# EAGLE design dynacomp (EAGLE 7.6.0)
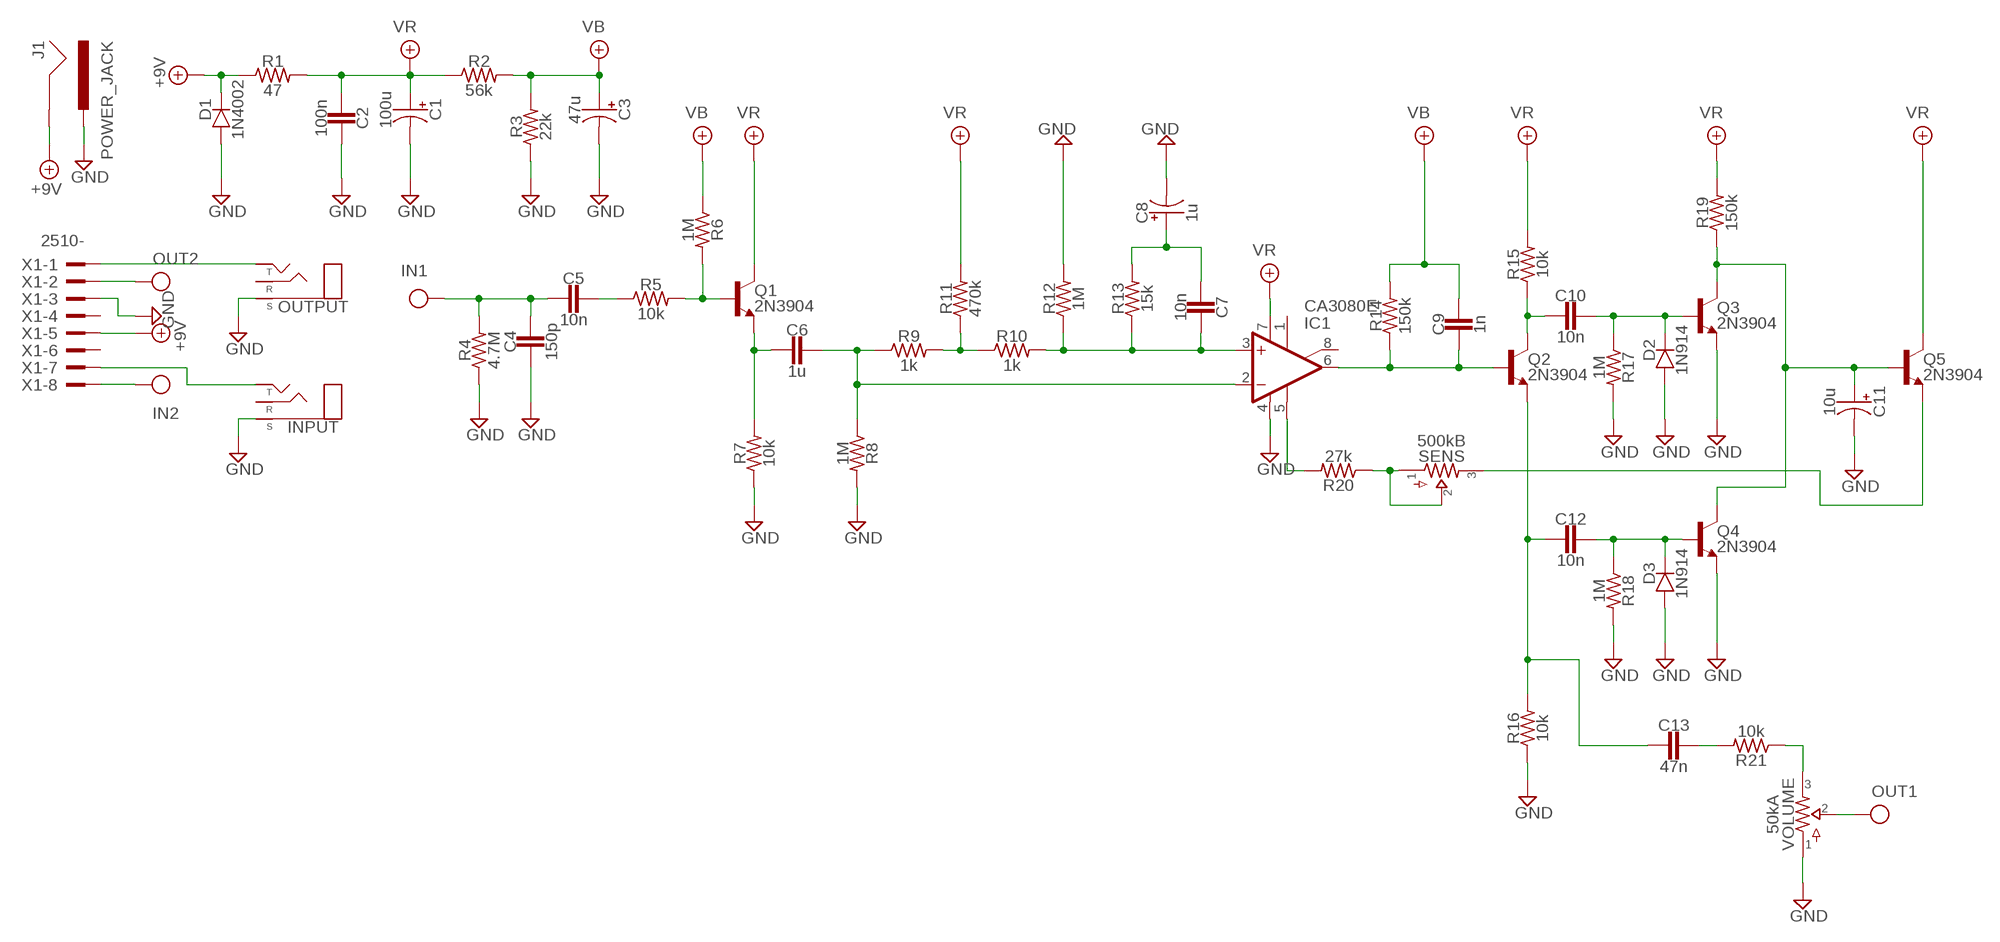
[diagram p0: schematic, sheet 1]

## Parts
C1  100u  0400  [040_020]
C2  100n  CER/FILM2  [050X030_025_2]
C3  47u  0400  [040_020]
C4  150p  CER/FILM2  [050X030_025_2]
C5  10n  CER/FILMBOX.1  [BOX_SMALL]
C6  1u  CER/FILMBOX.3  [BOX_BIG]
C7  10n  CER/FILMBOX.1  [BOX_SMALL]
C8  1u  0400  [040_020]
C9  1n  CER/FILMBOX.1  [BOX_SMALL]
C10  10n  CER/FILMBOX.1  [BOX_SMALL]
C11  10u  0400  [040_020]
C12  10n  CER/FILMBOX.1  [BOX_SMALL]
C13  47n  CER/FILMBOX.1  [BOX_SMALL]
D1  1N4002  DO41.2  [DO41-2]
D2  1N914  DO35.2  [DO35-2]
D3  1N914  DO35.2  [DO35-2]
IC1  CA3080E  3080TH  [DIL08]
INPUT  STEREONMJ  [NMJ6HCD2]
J1  POWER_JACK  [POWER_JACK_PTH]
OUTPUT  STEREONMJ  [NMJ6HCD2]
Q1  2N3904  [TO92-]
Q2  2N3904  [TO92-]
Q3  2N3904  [TO92-]
Q4  2N3904  [TO92-]
Q5  2N3904  [TO92-]
R1  47  R_.3B  [R0207/3]
R2  56k  R_.3B  [R0207/3]
R3  22k  R_.3B  [R0207/3]
R4  4.7M  R_.3B  [R0207/3]
R5  10k  R_.3B  [R0207/3]
R6  1M  R_.3B  [R0207/3]
R7  10k  R_.3B  [R0207/3]
R8  1M  R_.3B  [R0207/3]
R9  1k  R_.3B  [R0207/3]
R10  1k  R_.3B  [R0207/3]
R11  470k  R_.3B  [R0207/3]
R12  1M  R_.3B  [R0207/3]
R13  15k  R_.3B  [R0207/3]
R14  150k  R_.3B  [R0207/3]
R15  10k  R_.3B  [R0207/3]
R16  10k  R_.3B  [R0207/3]
R17  1M  R_.3B  [R0207/3]
R18  1M  R_.3B  [R0207/3]
R19  150k  R_.3B  [R0207/3]
R20  27k  R_.3B  [R0207/3]
R21  10k  R_.3B  [R0207/3]
SENS  500kB  POTS16MM  [16MM]
VOLUME  50kA  POTS16MM  [16MM]
X1  2510-  [PAK100/2500-10]

## Nets
+9V: D1.C J1.GND R1.1 X1.5
C8: C6.1 IC1.2(-IN) R8.1 R9.1
C10: C7.2 C8.+ R13.2
C40: C13.1 R21.2
GND: C1.- C2.1 C3.- C4.2 C8.- C11.- D1.A D2.A D3.A IC1.4(V-) INPUT.S J1.PWR OUTPUT.S Q3.3(E) Q4.3(E) R3.1 R4.1 R7.1 R8.2 R12.2 R16.1 R17.2 R18.2 VOLUME.1 X1.3
IN: C4.1 C5.2 R4.2 X1.8
N$1: C12.2 C13.2 Q2.3(E) R16.2
N$2: INPUT.T X1.7
N$3: C5.1 R5.1
N$4: OUTPUT.T X1.1
N$5: Q1.2(B) R5.2 R6.2
N$6: IC1.5(OPT) R20.2
N$8: C11.+ Q3.1(C) Q4.1(C) Q5.2(B) R19.1
N$9: C6.2 Q1.3(E) R7.2
N$10: C7.1 IC1.3(+IN) R10.2 R12.1 R13.1
N$11: R9.2 R10.1 R11.1
N$12: R20.1 SENS.1 SENS.2
N$13: Q5.3(E) SENS.3
N$14: C10.2 Q2.1(C) R15.1
N$15: C9.2 IC1.6(OUT) Q2.2(B) R14.1
N$16: R21.1 VOLUME.3
N$17: C10.1 D2.C Q3.2(B) R17.1
N$19: C12.1 D3.C Q4.2(B) R18.1
OUT: VOLUME.2 X1.2
VB: C3.+ C9.1 R2.2 R3.2 R6.1 R14.2
VR: C1.+ C2.2 IC1.7(V+) Q1.1(C) Q5.1(C) R1.2 R2.1 R11.2 R15.2 R19.2
Unconnected: IC1.1(ON1) IC1.8(ON2) INPUT.R OUTPUT.R X1.4 X1.6

## Library data of the parts
C1 C3 C8 C11 = pedals-capacitors-elec:040
C2 C4-C7 C9 C10 C12 C13 = pedals-capacitors-film:CER/FILM: 47 - 120pF Xicon Ceramic Disc 2.5mm lead spacing
D1 = pedals-diodes:DO41: DO-41 Package Diodes: 1N4001 - 1N40019 Zener Diodes: 1N4728 - 1N4764
D2 D3 = pedals-diodes:DO35: DO-35 Package Diodes: 1N914
IC1 = pedals-integrated circuits:3080: OP AMP
INPUT OUTPUT = pedals-jacks:STEREO
J1 = pedals-jacks:POWER_JACK: Power Jack Connector This is the standard 5.5mm barrel jack for power. The PTH is the most common, proven, reliable, footprint. The Slot footprint only works if the mill layer is transmitted to the PCB fab house so be warned. Here are the connectors we sell at SparkFun: DC Barrel Power Jack/Connector <https://www.sparkfun.com/products/119> (PRT-00119) DC Barrel Power Jack/Connector (SMD) <https://www.sparkfun.com/products/12748> (PRT-12748) DC Barrel Jack Adapter - Breadboard Compatible <https://www.sparkfun.com/products/10811> (PRT-10811) It is used on this SparkFun product (and many, many others): SparkFun RedBoard - Programmed with Arduino <https://www.sparkfun.com/products/12757> (DEV-12757) Also, if you need a mating power supply or connector, please check these out: Wall Adapter Power Supply - 9VDC 650mA <https://www.sparkfun.com/products/298> (TOL-00298) DC Barrel Jack Adapter - Male <https://www.sparkfun.com/products/10287> (PRT-10287); PROD_ID: CONN-08197
Q1-Q5 = pedals-transistors:2N3904: NPN Transistor
R1-R21 = pedals-resistors:R_
SENS VOLUME = pedals-potentiometers:POTS
X1 = pedals-headers:2510-: 3M (TM) Pak 100 4-Wall Header Source: 3M; MF: 3M; MPN: 2510-6002UB; OC_FARNELL: 9838244; OC_NEWARK: 46F4725

## Board
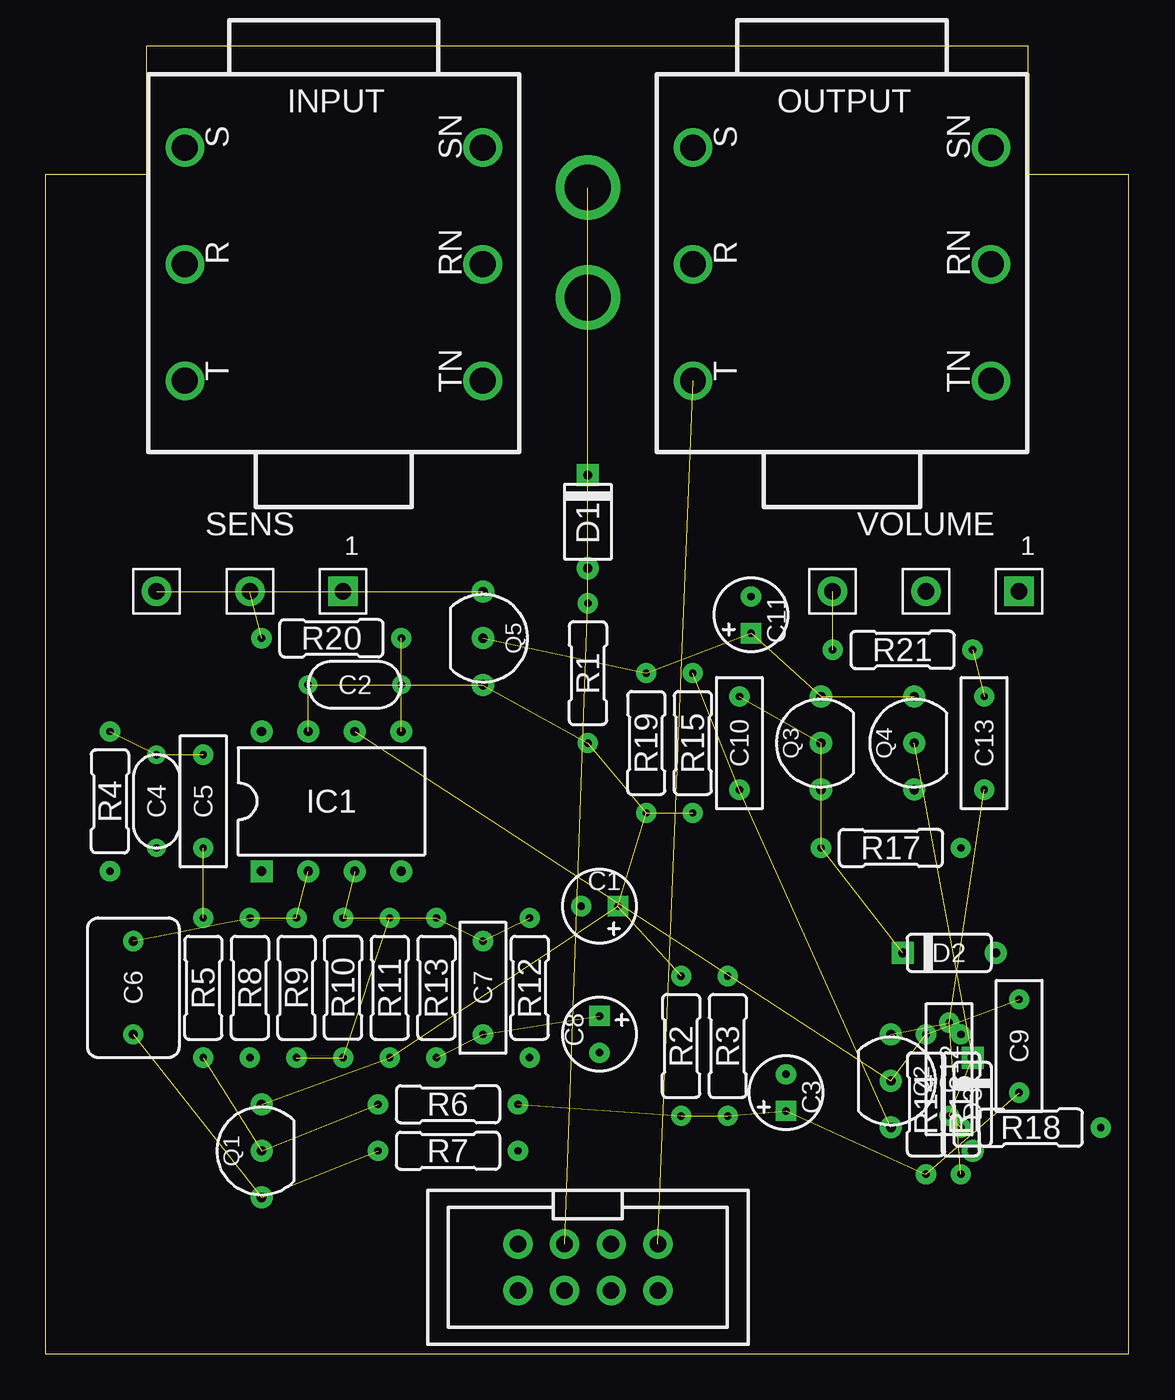
[diagram p1: board, top side]
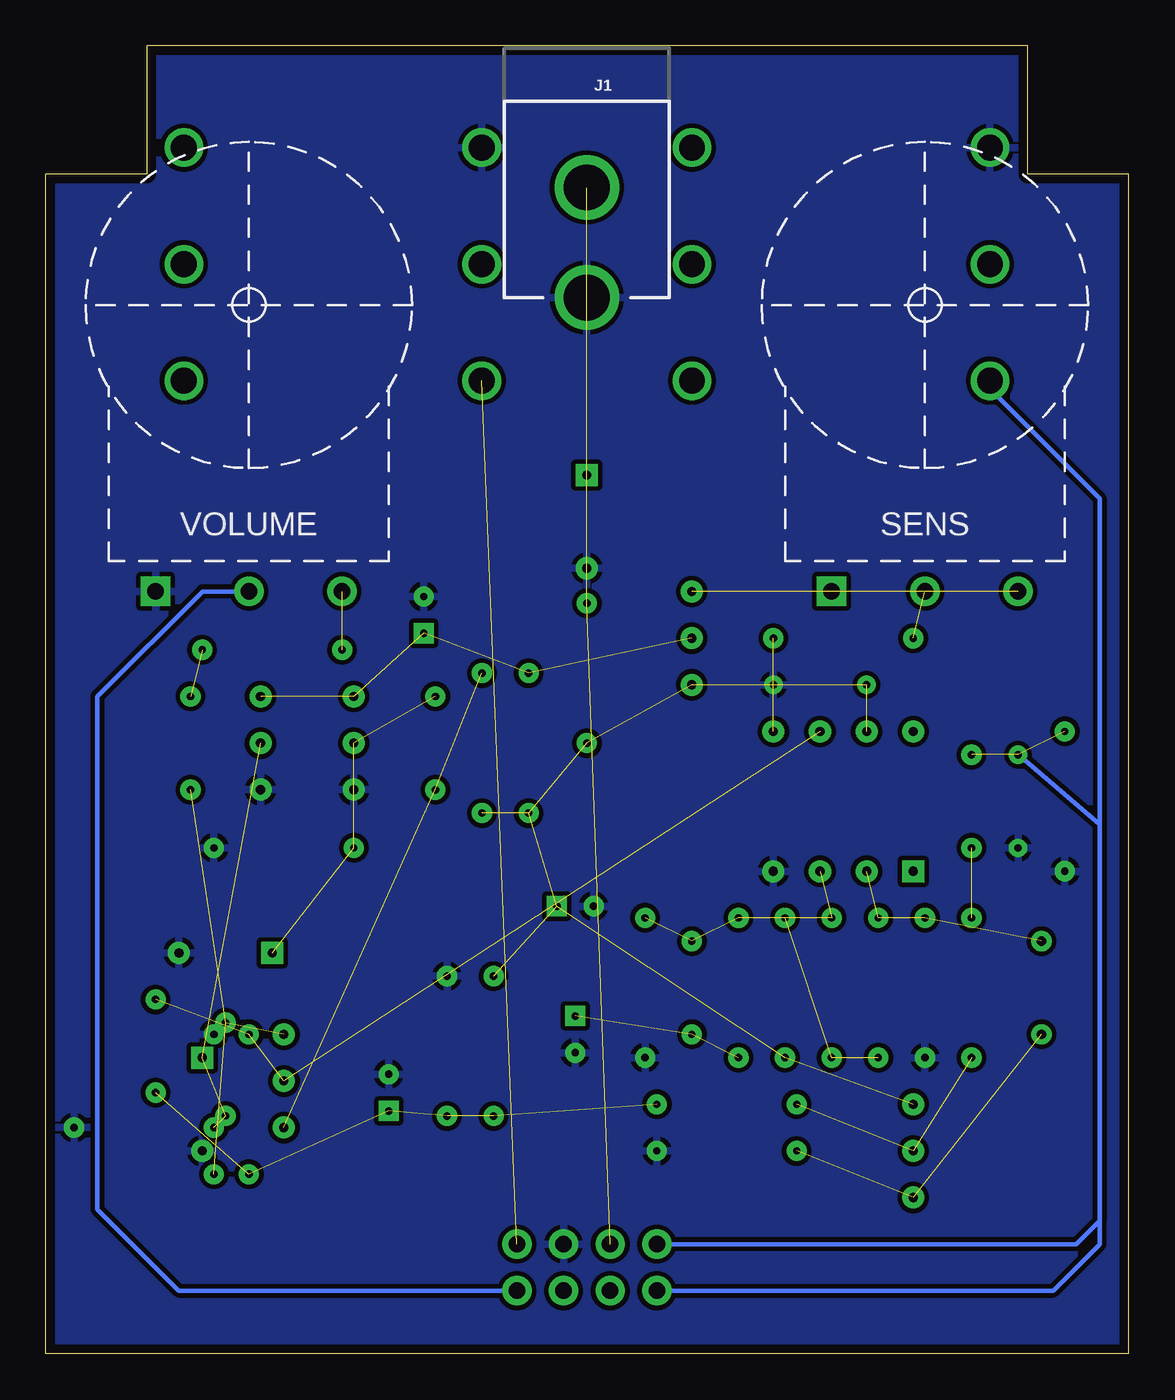
[diagram p2: board, bottom side, seen from below]

Size 59 x 71.27 mm. Coordinates in mm from the lower left corner, seen from the top.
Copper layers (1*16): Top 0.035mm / dielectric 1.6mm / Bottom 0.035mm
Design rules "Elecrow_2-layer_PCB_eagle_rule": minimum track width 6mil, minimum drill 12mil, track to track 6mil, track to pad 6mil, pad to pad 6mil, via to via 8mil, smd to smd 0mil, copper to edge 20mil, drill to drill 10mil, minimum pad ring 6mil, minimum via ring 6mil, stop-mask expansion 0mil, vias tented up to drill 100mil, thermal gap 10mil
tRestrict: 1 lines

### Footprints (pad centres in the part's own frame; a part is rotated, then mirrored left to right if it is on the bottom)
040_020 = drill 0.4 pad 1.1 square: + -1.001,0 | drill 0.4 pad 1.1: - 1.001,0
050X030_025_2 = drill 0.4 pad 1: 1 -2.54,0; 2 2.54,0
BOX_SMALL = drill 0.4 pad 1.1: 1 -2.54,0; 2 2.54,0
BOX_BIG = drill 0.5 pad 1.1: 1 -2.54,0; 2 2.54,0
DO41-2 = drill 0.5 pad 1.2: A 2.54,0 | drill 0.5 pad 1.2 square: C -2.54,0
DO35-2 = drill 0.5 pad 1.2: A 2.54,0 | drill 0.5 pad 1.2 square: C -2.54,0
DIL08 = drill 0.5 pad 1.2 square: 1 -3.81,-3.81 | drill 0.5 pad 1.2: 2 -1.27,-3.81; 3 1.27,-3.81; 4 3.81,-3.81; 5 3.81,3.81; 6 1.27,3.81; 7 -1.27,3.81; 8 -3.81,3.81
NMJ6HCD2 = drill 1.4: R 0,8.115; RN 0,-8.115; S 6.35,8.115; SN 6.35,-8.115; T -6.35,8.115; TN -6.35,-8.115
POWER_JACK_PTH = drill 2.5: GND 0,7.7; PWR 0,13.7
TO92- = drill 0.5 pad 1.2: 1 2.54,0; 2 0,0; 3 -2.54,0
R0207/3 = drill 0.4 pad 1.1: 1 -3.81,0; 2 3.81,0
16MM = drill 0.9 pad 1.6 square: 1 5.08,-1 | drill 0.9 pad 1.6: 2 0,-1; 3 -5.08,-1
PAK100/2500-10 = drill 0.9 pad 1.6: 1 -3.81,-1.27; 2 -3.81,1.27; 3 -1.27,-1.27; 4 -1.27,1.27; 5 1.27,-1.27; 6 1.27,1.27; 7 3.81,-1.27; 8 3.81,1.27

### Placement (x,y rotation side)
C1  30.16,24.38 180 top
C2  16.83,36.45 180 top
C3  40.32,14.22 90 top
C4  6.03,30.1 270 top
C5  8.57,30.1 90 top
C6  4.76,19.94 270 top
C7  23.81,19.94 270 top
C8  30.16,17.4 270 top
C9  53.02,16.76 90 top
C10  37.78,33.27 270 top
C11  38.42,40.26 90 top
C12  49.21,15.49 90 top
C13  51.12,33.27 270 top
D1  29.53,45.34 270 top
D2  49.21,21.84 0 top
D3  50.48,13.59 270 top
IC1  15.56,30.1 0 top
INPUT  15.68,59.37 90 top
J1  29.53,71.25 180 bottom
OUTPUT  43.37,59.37 90 top
Q1  11.75,11.05 90 top
Q2  46.04,14.86 270 top
Q3  42.23,33.27 90 top
Q4  47.31,33.27 90 top
Q5  23.81,38.99 270 top
R1  29.53,37.08 270 top
R2  34.61,16.76 270 top
R3  37.15,16.76 270 top
R4  3.49,30.1 90 top
R5  8.57,19.94 270 top
R6  21.91,13.59 180 top
R7  21.91,11.05 180 top
R8  11.11,19.94 270 top
R9  13.65,19.94 270 top
R10  16.19,19.94 90 top
R11  18.73,19.94 270 top
R12  26.35,19.94 270 top
R13  21.27,19.94 270 top
R14  47.94,13.59 270 top
R15  35.24,33.27 270 top
R16  49.85,13.59 270 top
R17  46.04,27.56 0 top
R18  53.66,12.32 0 top
R19  32.7,33.27 270 top
R20  15.56,38.99 0 top
R21  46.67,38.35 0 top
SENS  11.11,42.55 0 top
U$1  [125B_PCB]  0,1.27 0 top
VOLUME  47.94,42.55 0 top
X1  29.53,4.7 180 top

### Tracks (layer width: path | path; a pad name or v marks a point on that pad's centre or on a via)
+9V  (3 unrouted)
C8  (3 unrouted)
C10  (2 unrouted)
C40  (1 unrouted)
GND
  pour Bottom (isolate 0.254): 0.32,70.74 58.74,70.74 58.74,-1.02 0.32,-1.02
IN  (2 unrouted)
  Bottom 0.254: X1.8 4.13,3.43 1.59,5.97 1.59,28.83 C4.1
N$1  (3 unrouted)
N$2
  Bottom 0.254: INPUT.T 7.57,52.59 1.59,46.61 1.59,7.24 2.86,5.97 X1.7
N$3  (1 unrouted)
N$4  (1 unrouted)
N$5  (2 unrouted)
N$6  (1 unrouted)
N$8  (4 unrouted)
N$9  (2 unrouted)
N$10  (4 unrouted)
N$11  (2 unrouted)
N$12  (2 unrouted)
N$13  (1 unrouted)
N$14  (2 unrouted)
N$15  (3 unrouted)
N$16  (1 unrouted)
N$17  (3 unrouted)
N$19  (3 unrouted)
OUT
  Bottom 0.254: VOLUME.2 50.47,41.55 56.2,35.81 56.2,7.87 51.75,3.43 X1.2
VB  (5 unrouted)
VR  (9 unrouted)